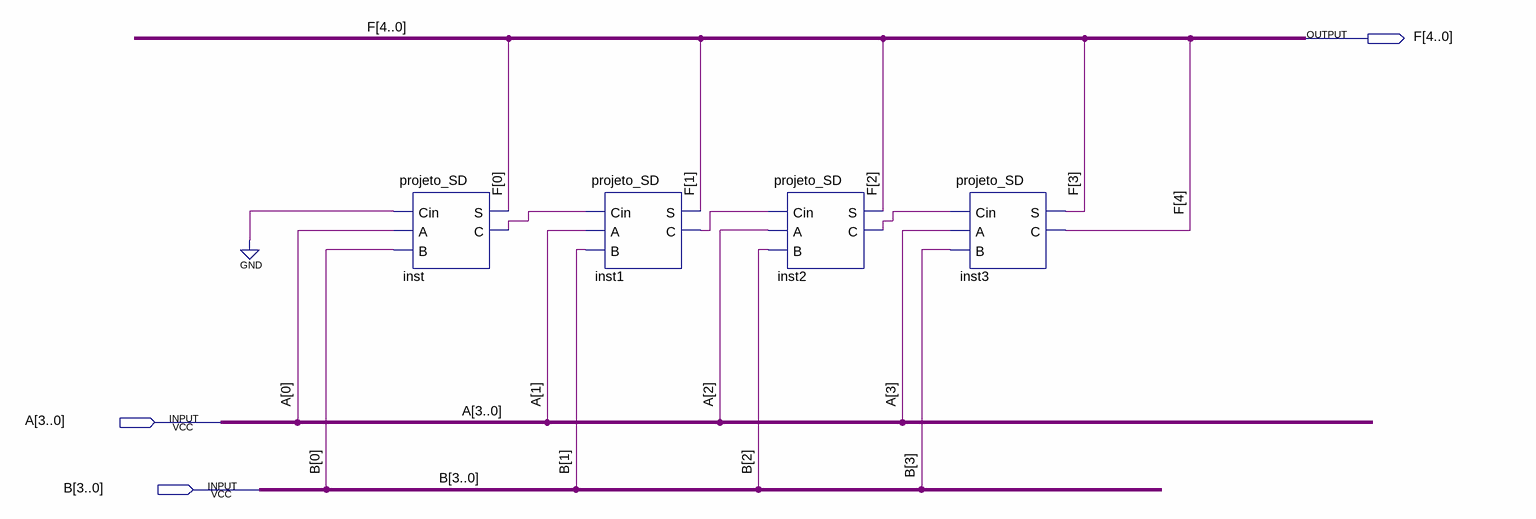
[diagram p0: schematic sheet]
// Quartus schematic somador_4bits.bdf as structural Verilog: 4 symbols, 3 pins
module somador_4bits (
  input  [3:0] A,
  input  [3:0] B,
  output [4:0] F
);

  wire inst1_c, inst2_c, inst_c;

  projeto_SD inst (.Cin(1'b0), .A(A[0]), .B(B[0]), .S(F[0]), .C(inst_c));
  projeto_SD inst1 (.Cin(inst_c), .A(A[1]), .B(B[1]), .S(F[1]), .C(inst1_c));
  projeto_SD inst2 (.Cin(inst1_c), .A(A[2]), .B(B[2]), .S(F[2]), .C(inst2_c));
  projeto_SD inst3 (.Cin(inst2_c), .A(A[3]), .B(B[3]), .S(F[3]), .C(F[4]));
endmodule
